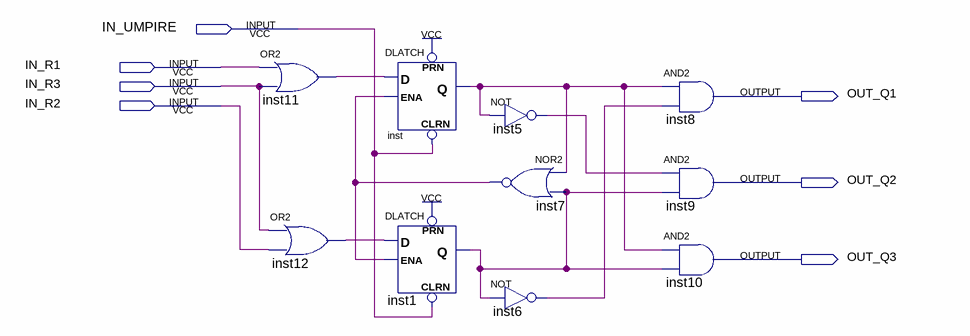
[diagram p0: schematic sheet]
// Quartus schematic DSLAB7_Q2.bdf as structural Verilog: 10 symbols, 7 pins
module DSLAB7_Q2 (
  input  IN_UMPIRE,
  input  IN_R1,
  input  IN_R3,
  input  IN_R2,
  output OUT_Q1,
  output OUT_Q2,
  output OUT_Q3
);

  wire inst1_q, inst5_out, inst6_out, inst7_out, inst11_out, inst12_out, inst_q;

  or inst11 (inst11_out, IN_R1, IN_R3);
  or inst12 (inst12_out, IN_R3, IN_R2);
  DLATCH inst (.CLRN(IN_UMPIRE), .D(inst11_out), .ENA(inst7_out), .PRN(1'b1), .Q(inst_q));
  DLATCH inst1 (.CLRN(IN_UMPIRE), .D(inst12_out), .ENA(inst7_out), .PRN(1'b1), .Q(inst1_q));
  not inst5 (inst5_out, inst_q);
  nor inst7 (inst7_out, inst_q, inst1_q);
  not inst6 (inst6_out, inst1_q);
  and inst8 (OUT_Q1, inst_q, inst6_out);
  and inst9 (OUT_Q2, inst5_out, inst1_q);
  and inst10 (OUT_Q3, inst_q, inst1_q);
endmodule
